# EAGLE design usb2ax_pro_top_TTL_v1.0 (EAGLE 7.6.0)
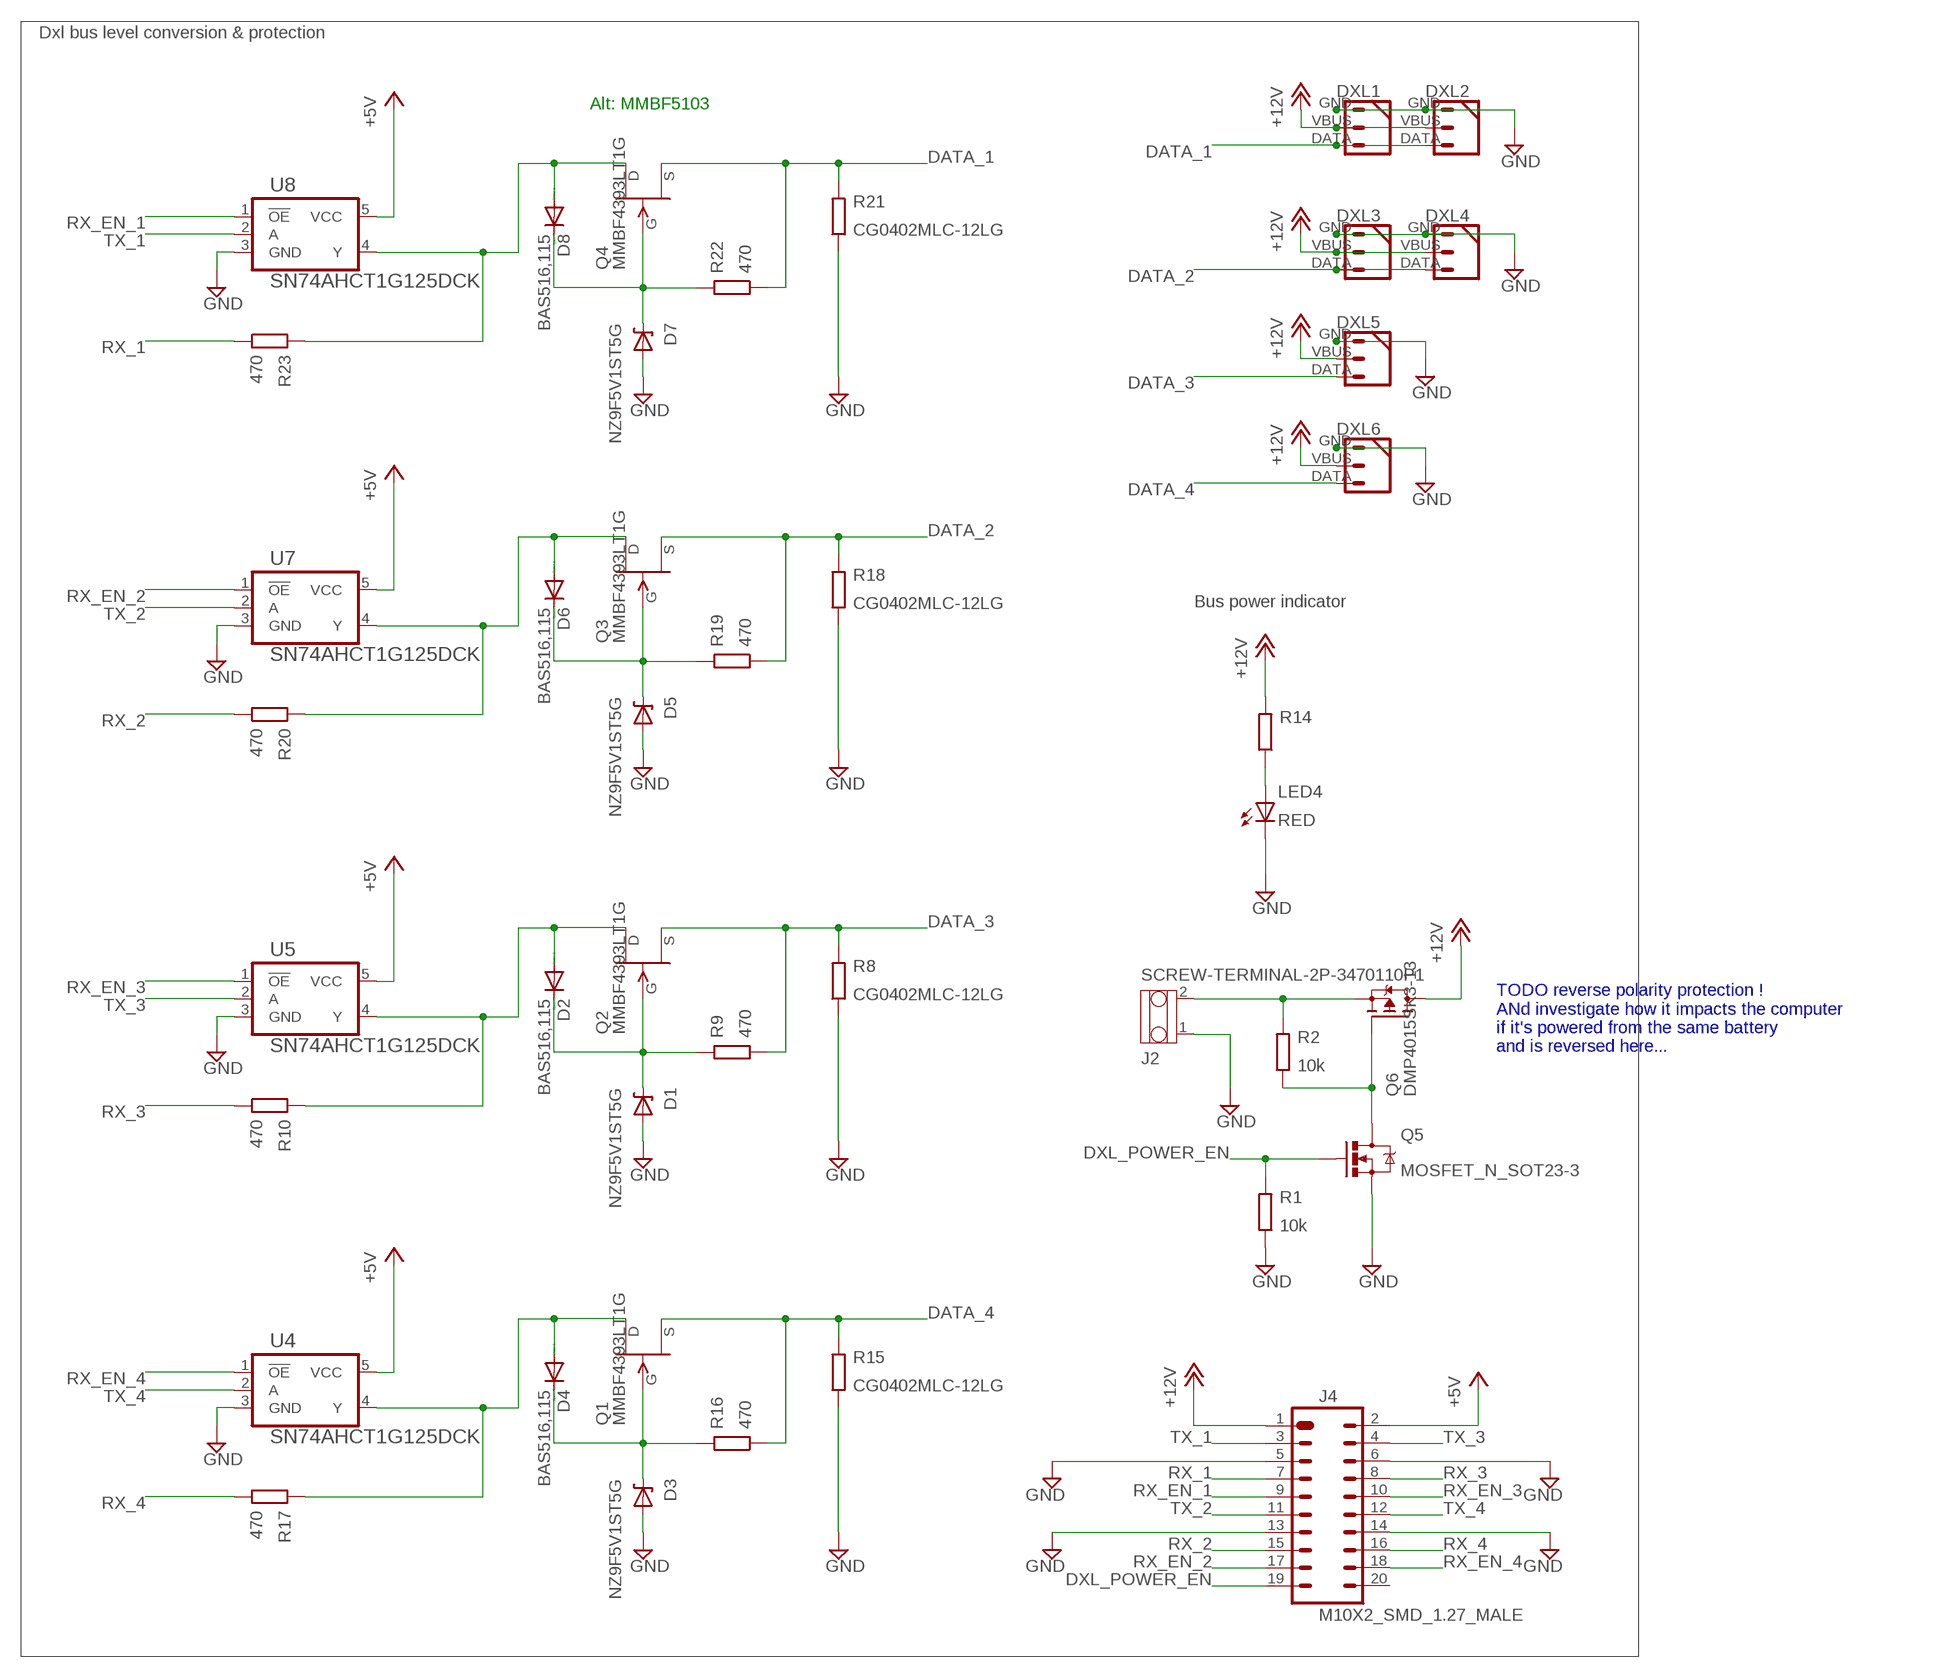
[diagram p0: schematic, sheet 1]

## Parts
D1  NZ9F5V1ST5G  DIODE_ZENER-923  [SOD-923_N]
D2  BAS516,115  DIODE-SOD523  [SOD523]
D3  NZ9F5V1ST5G  DIODE_ZENER-923  [SOD-923_N]
D4  BAS516,115  DIODE-SOD523  [SOD523]
D5  NZ9F5V1ST5G  DIODE_ZENER-923  [SOD-923_N]
D6  BAS516,115  DIODE-SOD523  [SOD523]
D7  NZ9F5V1ST5G  DIODE_ZENER-923  [SOD-923_N]
D8  BAS516,115  DIODE-SOD523  [SOD523]
DXL1  DYNAMIXEL_3POS-R  [DYNAMIXEL_3POS_RIGHT]
DXL2  DYNAMIXEL_3POS-R  [DYNAMIXEL_3POS_RIGHT]
DXL3  DYNAMIXEL_3POS-R  [DYNAMIXEL_3POS_RIGHT]
DXL4  DYNAMIXEL_3POS-R  [DYNAMIXEL_3POS_RIGHT]
DXL5  DYNAMIXEL_3POS-R  [DYNAMIXEL_3POS_RIGHT]
DXL6  DYNAMIXEL_3POS-R  [DYNAMIXEL_3POS_RIGHT]
J2  SCREW-TERMINAL-2P-3470110P1  [2P-5.0]
J4  M10X2_SMD_1.27_MALE  [2X10_SMD_1.27_MALE]
LED4  RED  LED0603  [D_0603_N]
Q1  MMBF4393LT1G  JFET_N_SOT-23-3_L  [SOT-23-3_L/SSOT-3_L]
Q2  MMBF4393LT1G  JFET_N_SOT-23-3_L  [SOT-23-3_L/SSOT-3_L]
Q3  MMBF4393LT1G  JFET_N_SOT-23-3_L  [SOT-23-3_L/SSOT-3_L]
Q4  MMBF4393LT1G  JFET_N_SOT-23-3_L  [SOT-23-3_L/SSOT-3_L]
Q5  MOSFET_N_SOT23-3  [SOT-23-3_N/SSOT-3_N]
Q6  DMP4015SK3-13  FDD4141TO252  [TO252]
R1  10k  R0402  [0402_N]
R2  10k  R0402  [0402_N]
R8  CG0402MLC-12LG  R0402  [0402_N]
R9  470  R0402  [0402_N]
R10  470  R0402  [0402_N]
R14  R0402  [0402_N]
R15  CG0402MLC-12LG  R0402  [0402_N]
R16  470  R0402  [0402_N]
R17  470  R0402  [0402_N]
R18  CG0402MLC-12LG  R0402  [0402_N]
R19  470  R0402  [0402_N]
R20  470  R0402  [0402_N]
R21  CG0402MLC-12LG  R0402  [0402_N]
R22  470  R0402  [0402_N]
R23  470  R0402  [0402_N]
U4  SN74AHCT1G125DCK  [SC70-5]
U5  SN74AHCT1G125DCK  [SC70-5]
U7  SN74AHCT1G125DCK  [SC70-5]
U8  SN74AHCT1G125DCK  [SC70-5]

## Nets
+5V: J4.2 U4.5(VCC) U5.5(VCC) U7.5(VCC) U8.5(VCC)
+12V: DXL1.VBUS DXL2.VBUS DXL3.VBUS DXL4.VBUS DXL5.VBUS DXL6.VBUS J4.1 Q6.3(D) R14.2
DATA_1: DXL1.DATA DXL2.DATA Q4.2(S) R21.2 R22.1
DATA_2: DXL3.DATA DXL4.DATA Q3.2(S) R18.2 R19.1
DATA_3: DXL5.DATA Q2.2(S) R8.2 R9.1
DATA_4: DXL6.DATA Q1.2(S) R15.2 R16.1
DXL_POWER_EN: J4.19 Q5.1(G) R1.2
GND: D1.A D3.A D5.A D7.A DXL1.GND DXL2.GND DXL3.GND DXL4.GND DXL5.GND DXL6.GND J2.1 J4.5 J4.6 J4.13 J4.14 LED4.C Q5.2(S) R1.1 R8.1 R15.1 R18.1 R21.1 U4.3(GND) U5.3(GND) U7.3(GND) U8.3(GND)
N$2: Q5.3(D) Q6.1(G) R2.1
N$7: D3.C D4.C Q1.3(G) R16.2
N$8: D1.C D2.C Q2.3(G) R9.2
N$9: D2.A Q2.1(D) R10.2 U5.4(Y)
N$10: LED4.A R14.1
N$11: D4.A Q1.1(D) R17.2 U4.4(Y)
N$12: D5.C D6.C Q3.3(G) R19.2
N$13: D6.A Q3.1(D) R20.2 U7.4(Y)
N$14: D7.C D8.C Q4.3(G) R22.2
N$15: J2.2 Q6.2(S) R2.2
N$21: D8.A Q4.1(D) R23.2 U8.4(Y)
RX_1: J4.7 R23.1
RX_2: J4.15 R20.1
RX_3: J4.8 R10.1
RX_4: J4.16 R17.1
RX_EN_1: J4.9 U8.1(!OE)
RX_EN_2: J4.17 U7.1(!OE)
RX_EN_3: J4.10 U5.1(!OE)
RX_EN_4: J4.18 U4.1(!OE)
TX_1: J4.3 U8.2(A)
TX_2: J4.11 U7.2(A)
TX_3: J4.4 U5.2(A)
TX_4: J4.12 U4.2(A)
Unconnected: J4.20

## Notes on the sheet
- Dxl bus level conversion & protection
- Alt: MMBF5103
- Bus power indicator
- TODO reverse polarity protection !
  ANd investigate how it impacts the computer
  if it's powered from the same battery
  and is reversed here...

## Library data of the parts
D1 D3 D5 D7 = Xevelabs:DIODE_ZENER: Zener Diode
D2 D4 D6 D8 = diode:DIODE-: DIODE
DXL1-DXL6 = Xevelabs:DYNAMIXEL_3POS
J2 = OPL:SCREW-TERMINAL-2P
J4 = Xevelabs:M10X2
LED4 = Xevelabs:LED: LED
Q1-Q4 = Xevelabs:JFET_N: TFS412S
Q5 = Xevelabs:MOSFET_N
Q6 = transistor-fet:FDD4141: P-Channel PowerTrench® MOSFET Source: FDD4141.pdf
R1 R2 R8-R10 R14-R23 = Xevelabs:R: Resistor
U4 U5 U7 U8 = Xevelabs:SN74AHCT1G125

## Board
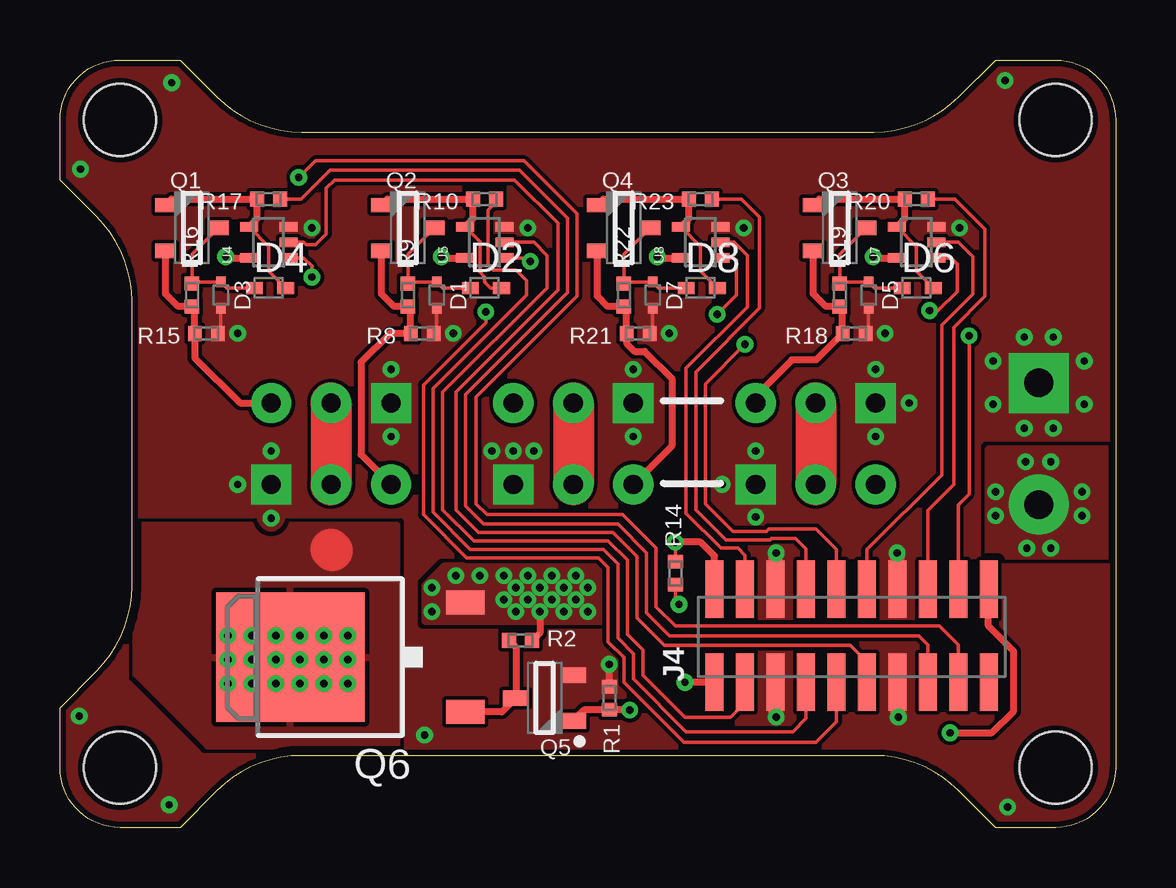
[diagram p1: board, top side]
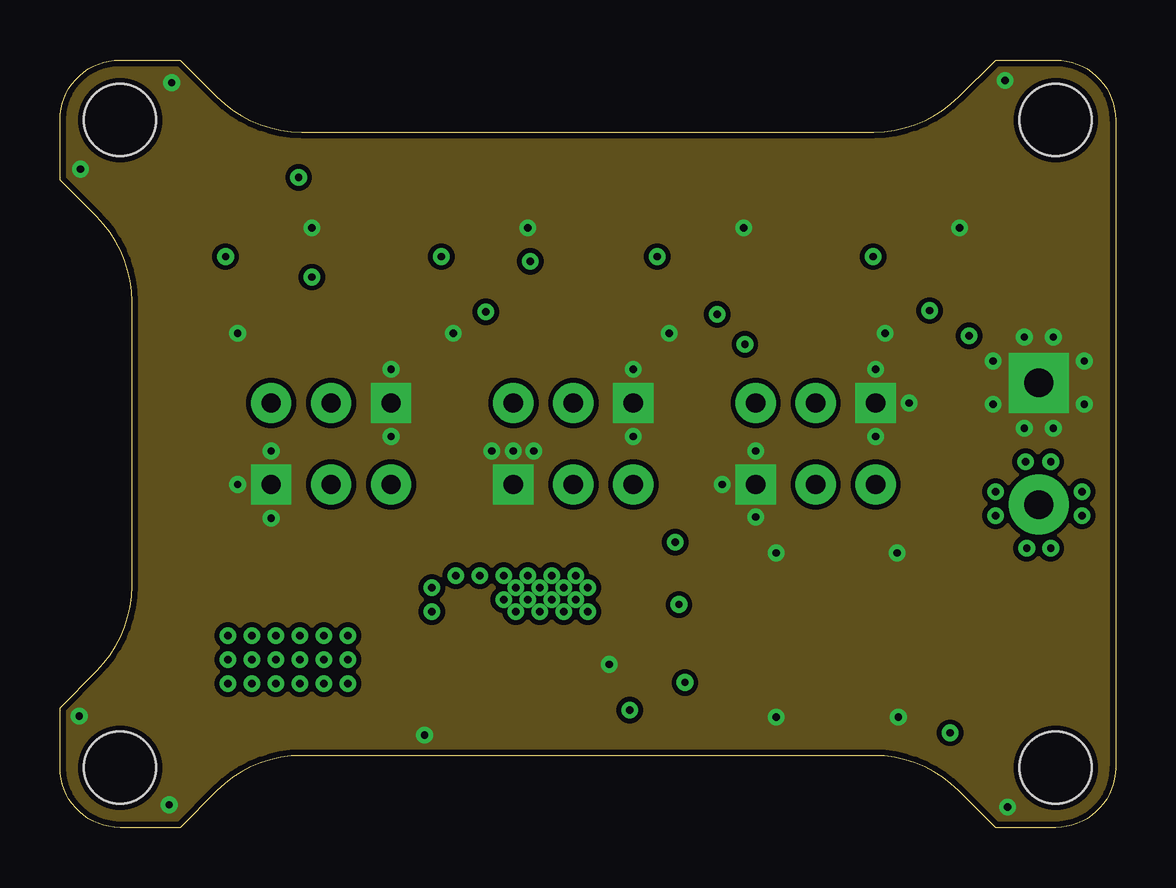
[diagram p2: board, inner layer Route2]
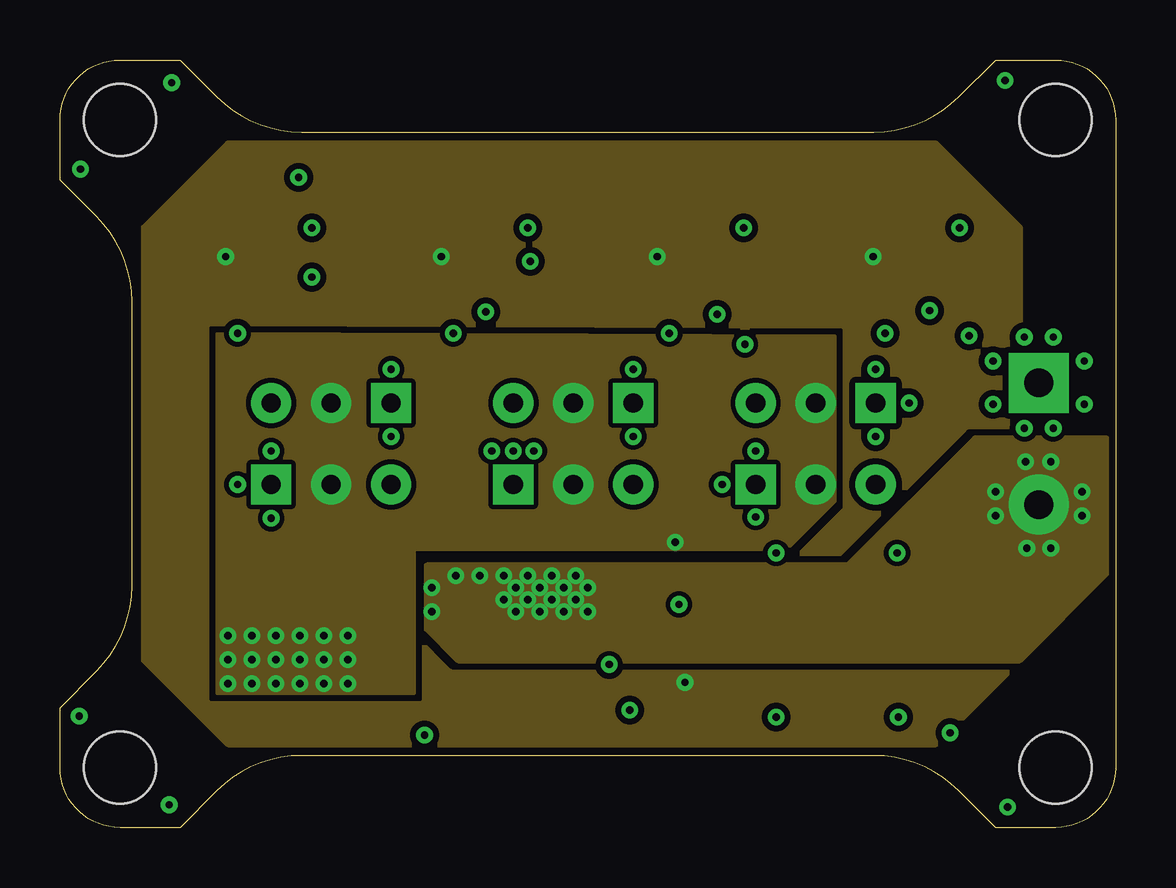
[diagram p3: board, inner layer Route3]
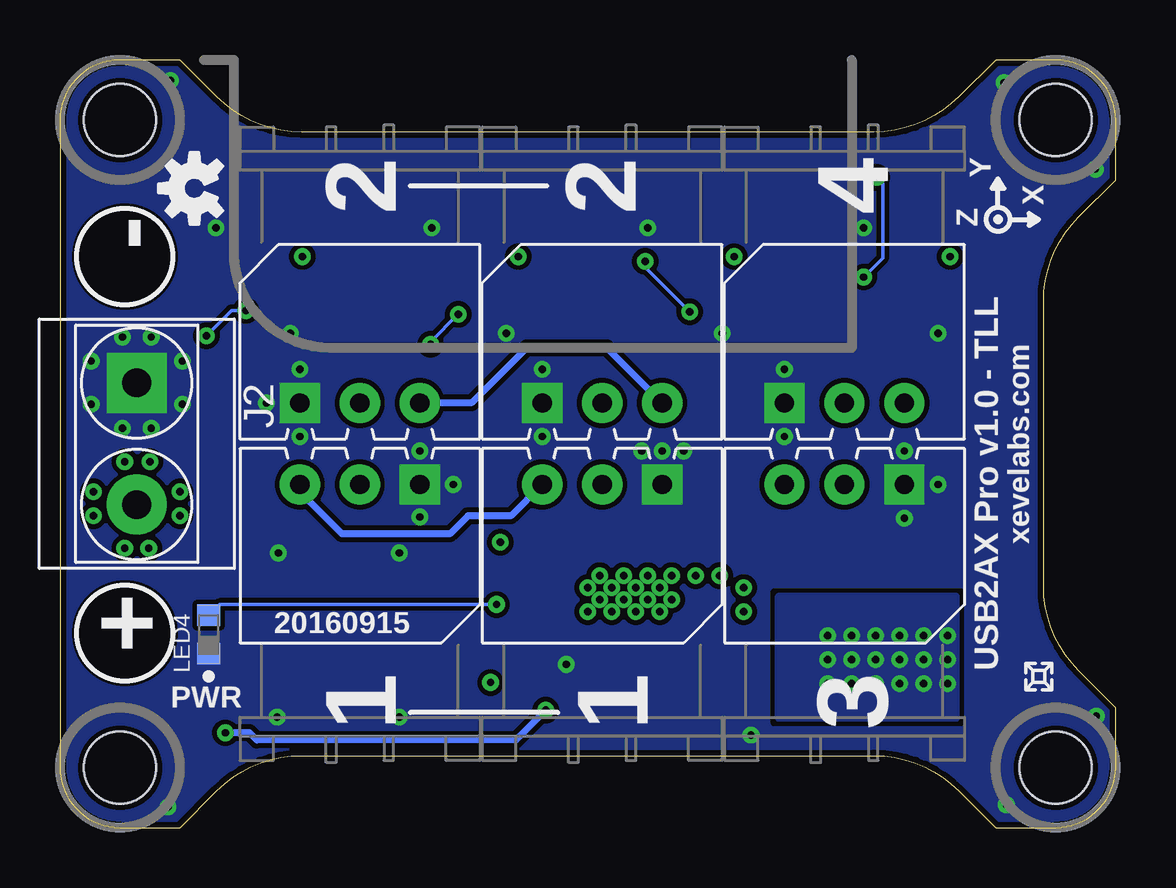
[diagram p4: board, bottom side, seen from below]

Size 44 x 32 mm. Coordinates in mm from the lower left corner, seen from the top.
Outline: 0,2.5 0,5 1.54,6.54 arc45 3,10.07 3,21.93 arc45 1.54,25.46 0,27 0,29.5 arc-90 2.5,32 5,32 6.54,30.46 arc45 10.07,29 33.93,29 arc45 37.46,30.46 39,32 41.5,32 arc-90 44,29.5 44,2.5 arc-90 41.5,0 39,0 37.46,1.54 arc45 33.93,3 10.07,3 arc45 6.54,1.54 5,0 2.5,0 arc-90 0,2.5
Copper layers (1*2*3*16): Top 0.035mm / dielectric 0.15mm / Route2 0.035mm / dielectric 1.1mm / Route3 0.035mm / dielectric 0.15mm / Bottom 0.035mm
Design rules "Xevelabs_6mil_4layers_eurocircuits": minimum track width 0.15mm, minimum drill 0.25mm, track to track 0.155mm, track to pad 0.155mm, pad to pad 0.155mm, via to via 0.155mm, smd to smd 0mil, copper to edge 0.25mm, drill to drill 0.25mm, minimum pad ring 0.15mm, minimum via ring 0.2mm, stop-mask expansion 0mil, vias tented up to drill 100mil, thermal gap 0.2mm
Holes 3 mm at 2.5,2.5 2.5,29.5 41.5,29.5 41.5,2.5
bRestrict: area 39.3,6.1 to 43.3,10.1; area 39.3,21.8 to 43.3,25.8

### Footprints (pad centres in the part's own frame; a part is rotated, then mirrored left to right if it is on the bottom)
SOD-923_N = smd 0.43 x 0.4: A 0.55,0; C -0.55,0
SOD523 = smd 0.7 x 0.5: A 0.7,0; C -0.6,0
DYNAMIXEL_3POS_RIGHT = drill 0.8 pad 1.676: DATA 0,-5; VBUS 0,-2.5 | drill 0.8 pad 1.676 square: GND 0,0
2P-5.0 = drill 1.2 pad 2.5 square: 1 -2.54,0 | drill 1.2 pad 2.5: 2 2.54,0
2X10_SMD_1.27_MALE = smd 2.4 x 0.75 bottom: 1 -1.94,5.715; 2 1.94,5.715; 3 -1.94,4.445; 4 1.94,4.445; 5 -1.94,3.175; 6 1.94,3.175; 7 -1.94,1.905; 8 1.94,1.905; 9 -1.94,0.635; 10 1.94,0.635; 11 -1.94,-0.635; 12 1.94,-0.635; 13 -1.94,-1.905; 14 1.94,-1.905; 15 -1.94,-3.175; 16 1.94,-3.175; 17 -1.94,-4.445; 18 1.94,-4.445; 19 -1.94,-5.715; 20 1.94,-5.715
D_0603_N = smd 0.9 x 0.95: A 0.8,0; C -0.8,0
SOT-23-3_L/SSOT-3_L = smd 0.85 x 0.6: 1 -1.1,0.95; 2 -1.1,-0.95; 3 1.1,0
SOT-23-3_N/SSOT-3_N = smd 1.05 x 0.65: 1 -1.2,0.95; 2 -1.2,-0.95; 3 1.2,0
TO252 = smd 1 x 1.6: 1 -2.28,-4.8; 2 2.28,-4.8 | smd 5.4 x 6.2: 3 0,2.5
0402_N = smd 0.57 x 0.62: 1 -0.48,0; 2 0.48,0
SC70-5 = smd 0.4 x 0.75: 1 -0.65,-0.825; 2 0,-0.825; 3 0.65,-0.825; 4 0.65,0.825; 5 -0.65,0.825

### Placement (x,y rotation side)
D1  15.7,22.2 270 top
D2  17.7,22.5 0 top
D3  6.7,22.2 270 top
D4  8.7,22.5 0 top
D5  33.7,22.2 270 top
D6  35.7,22.5 0 top
D7  24.7,22.2 270 top
D8  26.7,22.5 0 top
DXL1  29,14.3 270 bottom
DXL2  18.9,14.3 270 bottom
DXL3  34,17.7 90 bottom
DXL4  23.9,17.7 90 bottom
DXL5  8.8,14.3 270 bottom
DXL6  13.8,17.7 90 bottom
J2  40.8,16 270 bottom
J4  33,8 270 bottom
LED4  37.8,8.05 90 bottom
Q1  5.5,25 0 top
Q2  14.5,25 0 top
Q3  32.5,25 0 top
Q4  23.5,25 0 top
Q5  20.2,5.4 180 top
Q6  12.1,7.1 90 top
R1  22.9,5.4 270 top
R2  19.2,7.8 0 top
R8  15.1,20.6 180 top
R9  14.5,22.2 90 top
R10  17.7,26.2 180 top
R14  25.65,10.6 90 top
R15  6.1,20.6 180 top
R16  5.5,22.2 90 top
R17  8.7,26.2 180 top
R18  33.1,20.6 180 top
R19  32.5,22.2 90 top
R20  35.7,26.2 180 top
R21  24.1,20.6 180 top
R22  23.5,22.2 90 top
R23  26.7,26.2 180 top
U4  8.7,24.4 90 top
U5  17.7,24.4 90 top
U7  35.7,24.4 90 top
U8  26.7,24.4 90 top
U$1  [XEVELABS_LOGO_S]  3.25,6.25 0 bottom
U$2  [OSHW-LOGO-S]  38.4,26.65 90 bottom

### Tracks (layer width: path | path; a pad name or v marks a point on that pad's centre or on a via)
+5V  (via drill 0.3)
  Top 0.3: J4.2 v26.06,6.06 v26.05,6.05 | v15.9,23.8 15.95,23.75 U5.5 | v24.9,23.8 24.95,23.75 U8.5 | v33.9,23.8 33.95,23.75 U7.5 | v6.9,23.8 6.95,23.75 U4.5
  pour Route3 (isolate 0.25, rank 5): 3.5,25 3.5,7 7,3.5 36.5,3.5 40,7 40,25 36.5,28.5 7,28.5
+12V  (via drill 0.3)
  Top 0.15: v25.65,11.9 R14.2
  Top 0.3: Q6.3 9.9,7.1 v10,7 | J4.1 27.29,11.31 26.7,11.9 v25.65,11.9
  Top 1.7: 11.3,11.6 11.35,11.55 | DXL6.VBUS DXL5.VBUS | DXL4.VBUS DXL2.VBUS | DXL3.VBUS DXL1.VBUS
  other vias: 8,6 12,8 7,8 9,8 10,8 11,8 11,7 11,6 7,6 8,8 8,7 9,7 9,6 10,6 7,7 12,7 12,6
  pour Route3 (isolate 0.2, rank 3, no thermals): 6.55,20.6 32.3,20.5 32.3,13.6 30.3,11.6 14.75,11.6 14.75,5.6 6.55,5.6
  pour Bottom (isolate 0.4): 14.05,4.55 14.05,9.65 6.65,9.65 6.65,4.55
  pour Top (isolate 0.4): 14.05,3.4 14.05,12.6 3.15,12.6 3.15,6.4 6.15,3.4
DATA_1
  Top 0.3: Q4.2 22.4,22.15 22.83,21.72 R22.1 23.62,21.6 R21.2 23.62,20.18 23.95,19.85 24.37,19.85 25.5,18.72 25.5,15.9 DXL2.DATA
  Bottom 0.3: DXL2.DATA 25.2,13 27,13 27.75,12.25 32.25,12.25 34,14 DXL1.DATA
DATA_2
  Top 0.3: Q3.2 31.4,22.25 31.93,21.72 R19.1 32.62,21.6 R18.2 31.52,19.5 30.5,19.5 29,18 DXL3.DATA
  Bottom 0.3: DXL4.DATA 21.2,20 24.55,20 26.85,17.7 DXL3.DATA
DATA_3
  Top 0.3: Q2.2 13.4,22.25 13.93,21.72 R9.1 14.62,21.6 R8.2 13.75,20.6 12.55,19.4 12.55,15.55 DXL5.DATA
DATA_4
  Top 0.3: Q1.2 4.4,22.25 4.93,21.72 R16.1 5.62,21.6 R15.2 5.62,19.58 7.5,17.7 DXL6.DATA
DXL_POWER_EN  (via drill 0.3)
  Top 0.3: Q5.1 21.87,4.92 R1.2 23.73,4.92 v23.75,4.9 | v37.1,3.95 38.85,3.95 39.75,4.85 39.75,7.35 38.7,8.4 38.7,9.93 J4.19
  Bottom 0.3: v23.75,4.9 25,3.65 35.8,3.65 36.1,3.95 v37.1,3.95
GND  (via drill 0.3)
  Top 0.15: D3.A 6.7,20.72 R15.1 | D1.A 15.7,20.72 R8.1 | D7.A 24.7,20.72 R21.1 | D5.A 33.7,20.72 R18.1
  Top 0.3: R1.1 v22.9,6.8
  Top 0.6: v29.85,4.6 29.82,4.62 J4.6 | v34.95,4.6 34.91,4.64 J4.14 | v29.85,11.45 29.82,11.43 J4.5 | v34.9,11.45 v34.91,11.45 J4.13
  other vias: 25.4,20.6 28.5,25 34.4,20.6 37.5,25 10.5,25 7.4,20.6 19.5,25 16.4,20.6 40.2,20.45 41.4,20.45 42.7,19.45 42.7,17.65 41.4,16.65 40.2,16.65 38.9,17.65 38.9,19.45 13.8,19.1 13.8,16.3 23.9,19.1 23.9,16.3 34,19.1 34,16.3 35.4,17.7 29,15.7 29,12.95 27.6,14.3 18.9,15.7 8.8,15.7 7.4,14.3 8.8,12.9 19.75,15.7 18,15.7 0.85,27.45 4.65,31.05 0.8,4.65 4.55,0.95 39.5,0.85 39.4,31.15 15.2,3.85
  pour Bottom (isolate 0.2, rank 6, no thermals): 46,-2 46.3,33 -2.9,33.9 -3,-1.8
  pour Route2 (isolate 0.2, rank 6, no thermals): 46.1,-2.2 46.4,32.8 -2.8,33.7 -2.9,-2
  pour Top (rank 3, no thermals): 38.7,16.35 43.65,16.35 43.65,20.9 38.7,20.9
  pour Top (rank 6, no thermals): -1.75,33.45 45.6,33.45 45.6,-2.05 -1.8,-2.05 -1.8,32.65
N$2
  Top 0.3: Q6.1 18.42,4.82 Q5.3 19,7.52 R2.1
N$7
  Top 0.15: Q1.3 5.5,23.9 R16.2 5.57,22.75 D3.C 6.95,22.5 D4.C
N$8
  Top 0.15: Q2.3 14.5,23.9 R9.2 14.57,22.75 D1.C 15.95,22.5 D2.C
N$9
  Top 0.15: D2.A 17.95,22.5 17.7,22.75 17.7,22.95 17.5,23.15 17.5,24.43 U5.4
  Top 0.3: U5.4 17.22,25.39 R10.2 13.65,26.2 Q2.1
N$10  (via drill 0.3)
  Top 0.15: R14.1 25.65,9.45 v25.8,9.3
  Bottom 0.15: v25.8,9.3 37.35,9.3 LED4.A
N$11
  Top 0.15: U4.4 8.7,24.23 8.7,23.2 D4.A
  Top 0.3: U4.4 8.22,25.39 R17.2 4.65,26.2 Q1.1
N$12
  Top 0.15: Q3.3 32.5,23.9 R19.2 32.57,22.75 D5.C 33.95,22.5 D6.C
N$13
  Top 0.15: U7.4 35.7,24.23 35.7,23.2 D6.A
  Top 0.3: Q3.1 31.65,26.2 R20.2 35.22,25.39 U7.4
N$14
  Top 0.15: Q4.3 23.5,23.9 R22.2 23.57,22.75 D7.C 24.95,22.5 D8.C
N$15  (via drill 0.3)
  Top 0.3: v20,9 20,8.12 R2.2
  other vias: 40.25,15.25 41.3,15.25 39,14 42.6,14 39,13 42.6,13 40.3,11.65 41.3,11.65 15.5,9 15.5,10 16.5,10.5 17.5,10.5 18.5,10.5 18.5,9.5 19,9 19,10 19.5,10.5 19.5,9.5 20,10 20.5,10.5 20.5,9.5 21,10 21.5,10.5 21,9 21.5,9.5 22,10 22,9
  pour Top (no thermals): 16,10.9 15.2,10.1 15.2,8.6 22.7,8.6 22.7,10.9
  pour Top (isolate 0.3, no thermals): 38.7,11.3 38.7,15.8 43.65,15.8 43.65,11.3
  pour Route3 (isolate 0.2, rank 2, no thermals): 15.3,10.9 15.3,8.3 16.6,7 40,7 43.6,10.6 43.6,16.2 38.15,16.2 32.85,10.9
N$21
  Top 0.15: U8.4 26.7,24.23 26.7,23.2 D8.A
  Top 0.3: Q4.1 22.65,26.2 R23.2 26.22,25.39 U8.4
RX_1
  Top 0.15: J4.7 31.09,11.61 30.65,12.05 29.65,12.05 29.6,12 27.75,12 26.5,13.25 26.5,19 29.15,21.65 29.15,25.45 28.4,26.2 R23.1
RX_2
  Top 0.15: J4.15 36.17,13.22 37.25,14.3 37.25,20.85 38.55,22.15 38.55,24.95 37.3,26.2 R20.1
RX_3
  Top 0.15: J4.8 31.09,4.54 30.55,4 26.1,4 23.9,6.2 23.9,7.25 23.25,7.9 23.25,11 22.65,11.6 17.1,11.6 15.55,13.15 15.55,18.3 19.45,22.2 19.45,22.8 19,23.25 18.05,23.25 17.85,23.45 17.85,25.75 18.18,26.08 R10.1
RX_4
  Top 0.15: J4.16 36.17,7.62 35.8,8 25.4,8 24.45,8.95 24.45,11.45 23.25,12.65 17.65,12.65 16.9,13.4 16.9,18.05 21.15,22.3 21.15,25.4 19.15,27.4 11.25,27.4 10.05,26.2 R17.1
RX_EN_1  (via drill 0.3)
  Top 0.15: J4.9 32.37,11.59 31.5,12.45 29.55,12.45 29.45,12.35 28.05,12.35 26.9,13.5 26.9,18.5 v28.55,20.15 | U8.1 28.1,23.75 28.2,23.65 28.2,22.2 v27.4,21.4
  Bottom 0.15: v27.4,21.4 28.55,20.25 v28.55,20.15
RX_EN_2  (via drill 0.3)
  Top 0.15: U7.1 37.15,23.75 37.4,23.5 37.4,22.35 36.6,21.55 v36.25,21.55 | J4.17 37.45,13.45 37.9,13.9 v37.9,20.5
  Bottom 0.15: v37.9,20.5 36.85,21.55 v36.25,21.55
RX_EN_3  (via drill 0.3)
  Top 0.15: J4.10 32.37,4.42 31.5,3.55 26,3.55 23.5,6.05 23.5,7.1 22.85,7.75 22.85,10.85 22.45,11.25 16.95,11.25 15.15,13.05 15.15,18.45 17.75,21.05 v17.75,21.5 | U5.1 19.45,23.75 v19.6,23.6
  Bottom 0.15: v17.75,21.5 19.6,23.35 v19.6,23.6
RX_EN_4  (via drill 0.3)
  Top 0.15: J4.18 37.45,7.61 36.65,8.4 25.65,8.4 24.85,9.2 24.85,11.65 23.45,13.05 17.8,13.05 17.35,13.5 17.35,17.95 21.55,22.15 21.55,25.6 19.35,27.8 10.65,27.8 v9.95,27.1 | v10.5,22.95 10.5,23.4 10.15,23.75 U4.1
  Bottom 0.15: v10.5,22.95 9.7,23.75 9.7,26.85 v9.95,27.1
TX_1
  Top 0.15: J4.3 28.55,11.35 28.25,11.65 27.55,11.65 26.1,13.1 26.1,19.15 28.65,21.7 28.65,23.85 28.1,24.4 U8.2
TX_2
  Top 0.15: J4.11 33.63,11.59 36.75,14.7 36.75,20.95 38.05,22.25 38.05,23.8 37.45,24.4 U7.2
TX_3
  Top 0.15: J4.4 28.55,5.21 27.95,4.6 26.05,4.6 24.3,6.35 24.3,7.4 23.65,8.05 23.65,11.15 22.85,11.95 17.25,11.95 15.95,13.25 15.95,18.15 20.3,22.5 20.3,23.85 19.75,24.4 U5.2
TX_4
  Top 0.15: J4.12 33.63,6.92 32.95,7.6 25.2,7.6 24.05,8.75 24.05,11.3 23.05,12.3 17.45,12.3 16.5,13.25 16.5,18.15 20.75,22.4 20.75,25.2 18.95,27 11.45,27 11.1,26.65 11.1,24.75 10.65,24.3 10.25,24.3 10.15,24.4 U4.2

### Text on the board
bPlace: Y | 4 | 2 | 2 | X | - | Z | xevelabs.com | USB2AX Pro v1.0 - TLL | + | 20160915 | 3 | 1 | 1 | PWR